# Altium project 110-00315-D_B1-DevKit_1.PrjPcb (part 2 of 5)

## Sheet 4-CPUMipiXo.SchDoc: B1 DevKit (DK-B1)
size 431 x 279 mm; Organization: ORGANIZATION; Address1: ADDRESS 1; Address2: ADDRESS 2; Address3: ADDRESS 3; Address4: ADDRESS 4; DocumentNumber: 4; Revision: -; SheetNumber: 4; SheetTotal: 14; ENG_APP_DATE: --/--/--; DSN_APP_DATE: --/--/--; CHK_APP_DATE: --/--/--
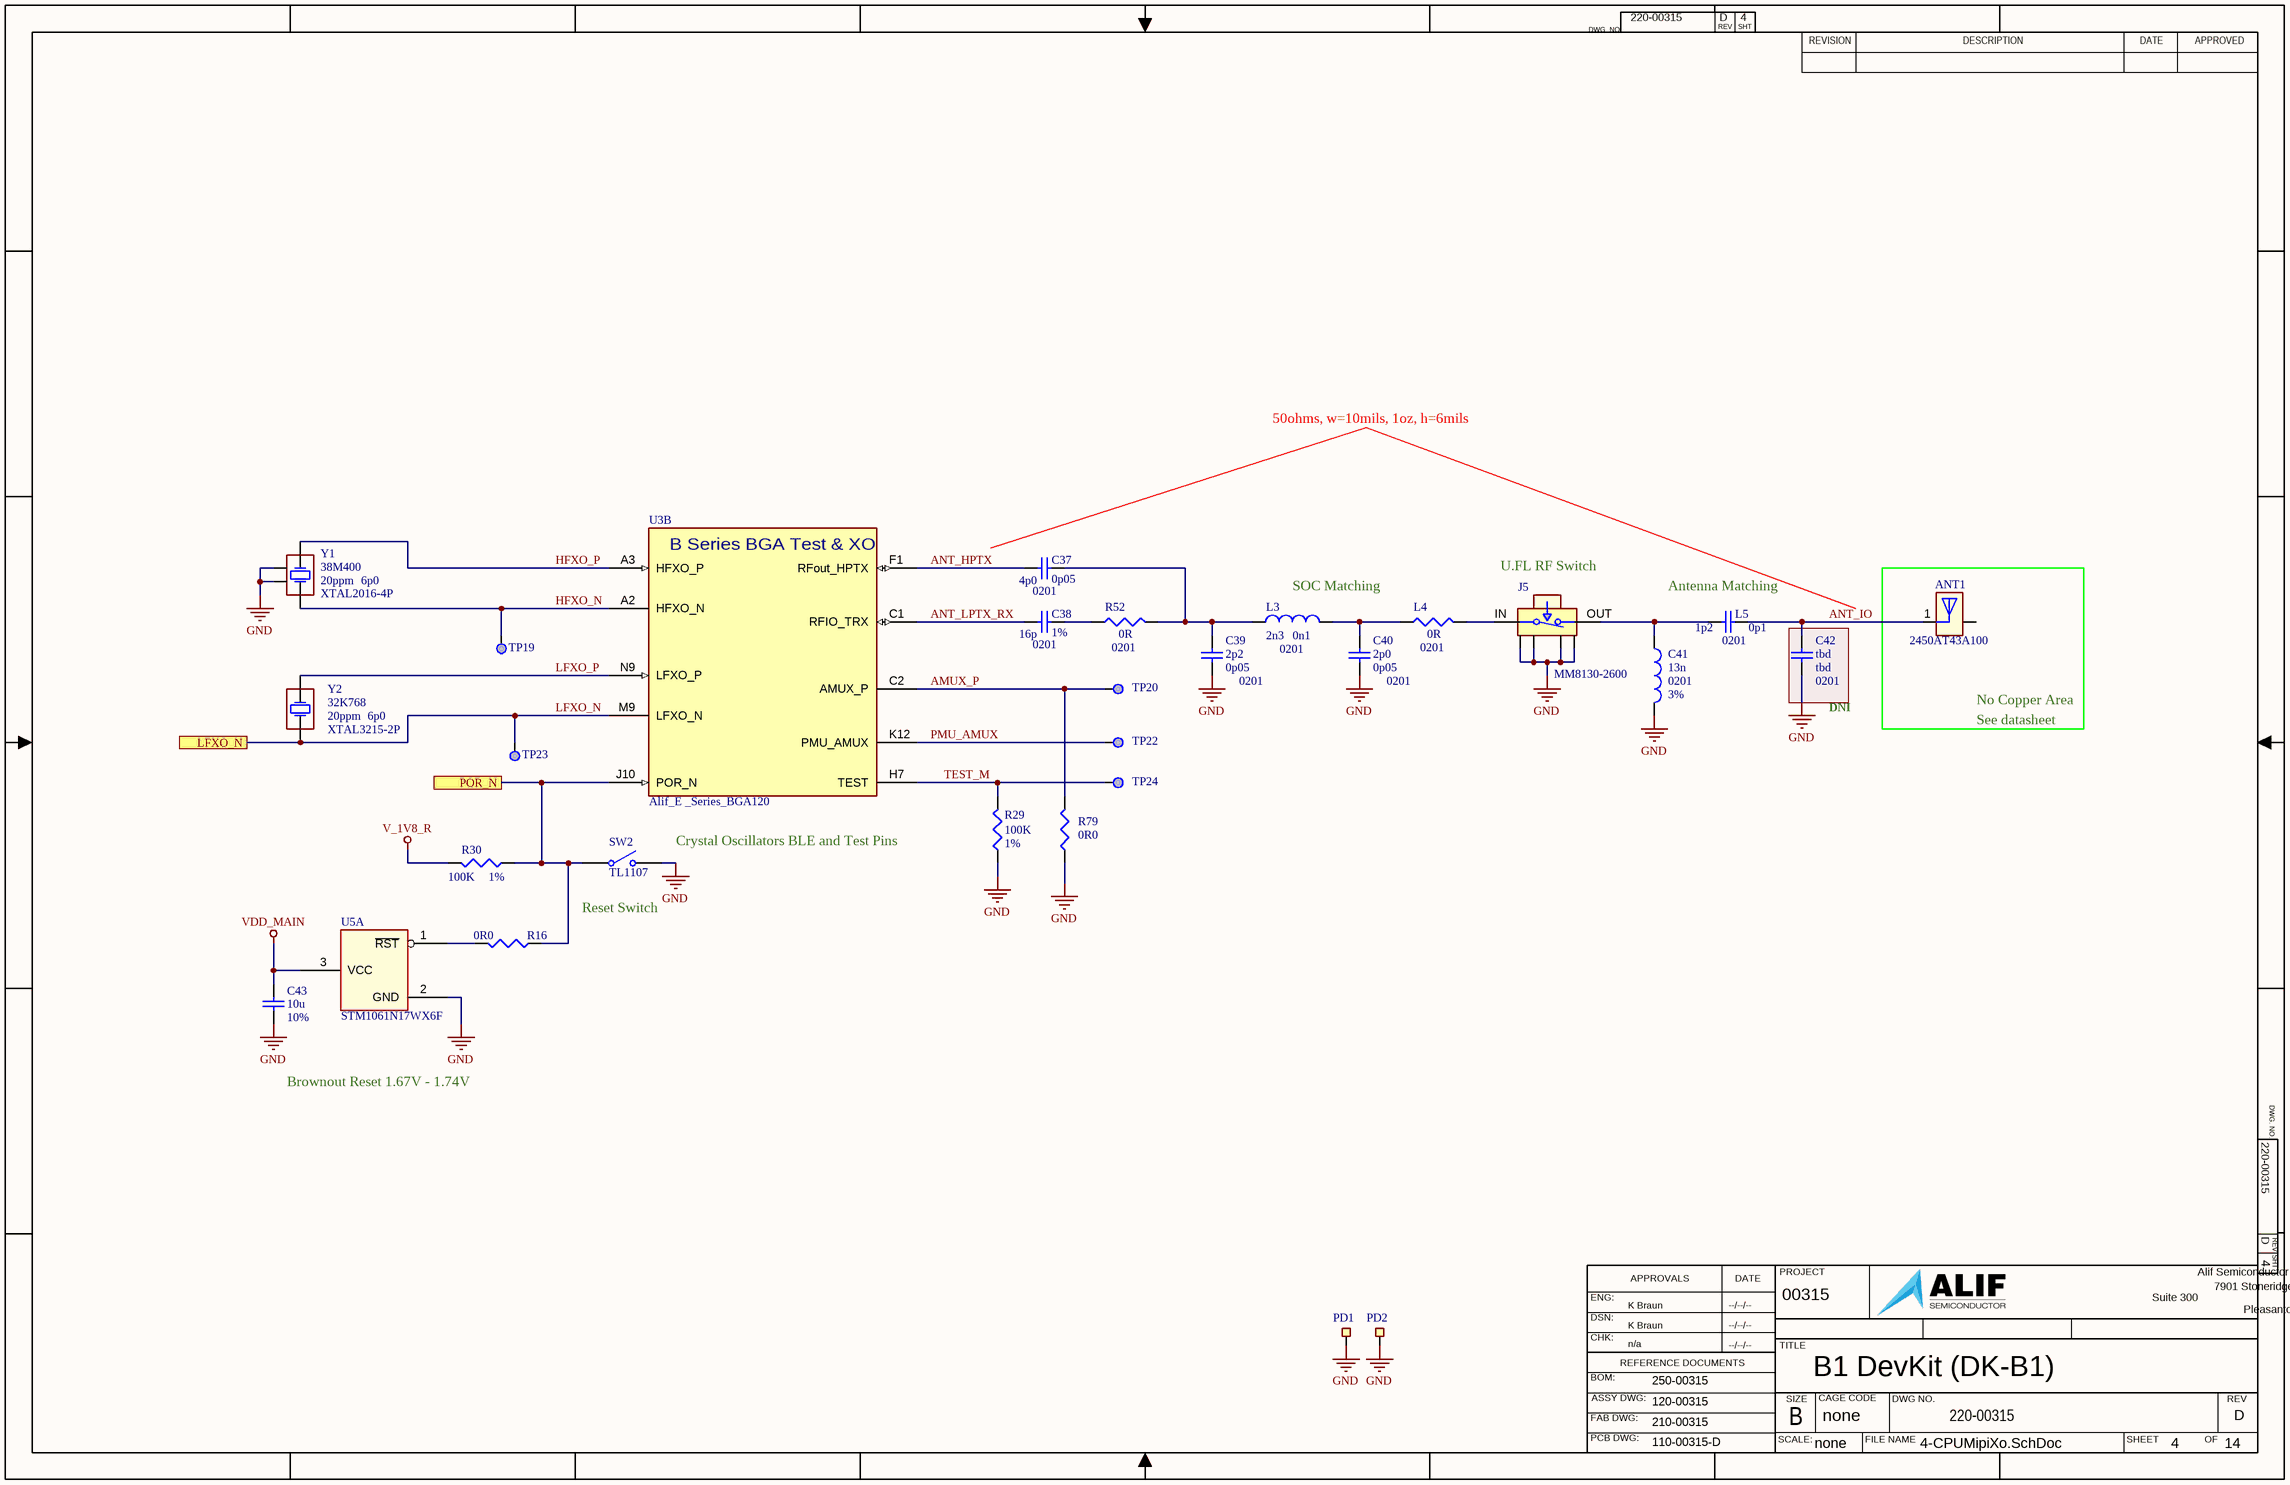
[diagram p3: 4-CPUMipiXo.SchDoc]

### Parts
ANT1  2450AT43A100  [ANT_JOT_2450AT43A100_JOD]
C37  value 4p0  PCB_Footprint: 0201  Tolerance: 0p05  [CC0201_RF10]  (hidden comment: Cap)
C38  value 16p  PCB_Footprint: 0201  Tolerance: 1%  [CC0201_RF10]  (hidden comment: Cap)
C39  value 2p2  PCB_Footprint: 0201  Tolerance: 0p05  [CC0201_RF10]  (hidden comment: Cap)
C40  value 2p0  PCB_Footprint: 0201  Tolerance: 0p05  [CC0201_RF10]  (hidden comment: Cap)
C41  value 13n  PCB_Footprint: 0201  Tolerance: 3%  [LC0201_RF10]  (hidden comment: Inductor)
C42  value tbd  PCB_Footprint: 0201  Tolerance: tbd  [CC0201_RF10]  (hidden comment: Cap)
C43  value 10u  Tolerance: 10%  [CAPC0402-01]  (hidden comment: Cap)
J5  MM8130-2600  [CONN_U.FL_SWITCH_MURATA_MM8130-2600RA2]
L3  value 2n3  PCB_Footprint: 0201  Tolerance: 0n1  [LC0201_RF10]  (hidden comment: Inductor)
L4  value 0R  PCB_Footprint: 0201  [RC0201_RF10]  (hidden comment: Res3)
L5  value 1p2  PCB_Footprint: 0201  Tolerance: 0p1  [CC0201_RF10]  (hidden comment: Cap)
PD1  PAD_10x10  [PAD_RF10x10]  (value not drawn)  (no BOM)
PD2  PAD_10x10  [PAD_RF10x10]  (value not drawn)  (no BOM)
R16  value 0R0  [RESC0402-01]  (hidden comment: Res3)
R29  value 100K  Tolerance: 1%  [RESC0402-01]  (hidden comment: Res3)
R30  value 100K  Tolerance: 1%  [RESC0402-01]  (hidden comment: Res3)
R52  value 0R  PCB_Footprint: 0201  [RC0201_RF10]  (hidden comment: Res3)
R79  value 0R0  [RESC0402-01]  (hidden comment: Res3)
SW2  value TL1107  [SW_1825966-TL1107-1]  (hidden comment: SW-SPST)
TP19  TP_SMPAD  [TP_30_RND]  (value not drawn)  (no BOM)
TP20  TP_SMPAD  [TP_30_RND]  (value not drawn)  (no BOM)
TP22  TP_SMPAD  [TP_30_RND]  (value not drawn)  (no BOM)
TP23  TP_SMPAD  [TP_30_RND]  (value not drawn)  (no BOM)
TP24  TP_SMPAD  [TP_30_RND]  (value not drawn)  (no BOM)
U3  Alif_E _Series_BGA120  [BGA120_socket-NO_SOCK_3D]  (part B of 4)
U5  STM1061N17WX6F  [SOT-23_DBZ_TEX]  (part A of 2)
Y1  value 38M400  PCB_Footprint: XTAL2016-4P  PPM: 20ppm  Load Cap: 6p0  [OSC_4p_2016_XRCGB38M400F2P00R0]  (hidden comment: Xtal_38M4_20PPM6PF_2016-4P_1)
Y2  value 32K768  PCB_Footprint: XTAL3215-2P  PPM: 20ppm  Load Cap: 6p0  [XTAL_ABS07_ABR-M]  (hidden comment: Xtal_32K768_20PPM6PF_3215-2P_1)

### Ports
LFXO_N, POR_N

### Nets
GND: C39.1 C40.1 C41.2 C42.1 C43.1 J5.G1 J5.G2 J5.G3 J5.G4 PD1.1 PD2.1 R29.1 R79.1 SW2.2(NO) U5.2(GND) Y1.2 Y1.4
V_1V8_R: R30.2
VDD_MAIN: C43.2 U5.3(VCC)
AMUX_P: R79.2 TP20.1 U3.C2(AMUX_P)
ANT_HPTX: C37.2 U3.F1(RFout_HPTX)
ANT_IO: ANT1.1(INPUT) C42.2 L5.1
ANT_LPTX_RX: C38.2 U3.C1(RFIO_TRX)
HFXO_N: TP19.1 U3.A2(HFXO_N) Y1.3(OSC2)
HFXO_P: U3.A3(HFXO_P) Y1.1(OSC1)
LFXO_N: TP23.1 U3.M9(LFXO_N) Y2.1(OSC1) ; port LFXO_N
LFXO_P: U3.N9(LFXO_P) Y2.2(OSC2)
PMU_AMUX: TP22.1 U3.K12(PMU_AMUX)
POR_N: R16.1 R30.1 SW2.1(COMMON) U3.J10(POR_N) ; port POR_N
TEST_M: R29.2 TP24.1 U3.H7(TEST)
NetC37_1: C37.1 C39.2 L3.1 R52.2
NetC38_1: C38.1 R52.1
NetC40_2: C40.2 L3.2 L4.1
NetC41_1: C41.1 J5.OUT L5.2
NetJ5_IN: J5.IN L4.2
NetR16_2: R16.2 U5.1(~{RST})

Not connected (* = marked no-connect by the designer): ANT1 3(GND)

### Notes on the sheet
- 50ohms, w=10mils, 1oz, h=6mils
- U.FL RF Switch
- SOC Matching
- (near L5) Antenna Matching
- No Copper Area
- (near C42) DNI
- See datasheet
- Crystal Oscillators BLE and Test Pins
- Reset Switch
- Brownout Reset 1.67V - 1.74V
- DWG. NO.
- REV
- SHT
- REVISION
- DESCRIPTION
- DATE
- APPROVED
- ENG:
- APPROVALS
- PROJECT
- Suite 300
- Alif Semiconductor
- 7901 Stoneridge Drive
- DSN:
- CHK:
- REFERENCE DOCUMENTS
- TITLE
- Pleasanton, CA 94588  USA
- BOM:
- FAB DWG:
- PCB DWG:
- ASSY DWG:
- SCALE:
- SIZE
- B
- CAGE CODE
- FILE NAME
- DWG NO.
- SHEET
- OF
- none
- (in symbol SPARK_B1_120BGA_A5, part B) B Series BGA Test & XO

### Library data of the parts
ANT1 = ANT_2450AT43A100: Antenna, Chip, 2.4GHz Bluetooth, ISM, Wi-Fi,  2.7dBi; Manufacturer 1: Johanson; Manufacturer Part Number 1: 2450AT43A0100001E; SnapEDA_Link: https://www.snapeda.com/parts/ACAG0201-2450-T/Abracon+LLC/view-part/?ref=snap; Package: None; Value: *; Check_prices: https://www.snapeda.com/parts/ACAG0201-2450-T/Abracon+LLC/view-part/?ref=eda
C37 = Cap_SMT: Cap,4.0pF,+-0.05pF,>=25V,C0G,0201; Manufacturer 1: MuRata; Manufacturer Part Number 1: GJM0335C1E4R0WB01D; Voltage: 25V; Published: 8-Jun-2000; LatestRevisionDate: 17-Jul-2002; LatestRevisionNote: Re-released for DXP Platform.; PackageReference: RAD-0.3; Publisher: Altium Limited; PackageDescription: Radial Cap, Thru-Hole; 2 Leads; 0.3 in Pin Spacing; Max_Height: 0.60mm; Manufacturer 2: Kemet; Manufacturer Part Number 2: CBR02C409A5GAC; Manufacturer 3: *; Manufacturer Part Number 3: *; Type: C0G
C38 = Cap_SMT: Cap,16pF,1%,50V,C0G,0201; Manufacturer 1: MuRata; Manufacturer Part Number 1: GCM0335C1H160FA16J; Voltage: 25V; Published: 8-Jun-2000; LatestRevisionDate: 17-Jul-2002; LatestRevisionNote: Re-released for DXP Platform.; PackageReference: RAD-0.3; Publisher: Altium Limited; PackageDescription: Radial Cap, Thru-Hole; 2 Leads; 0.3 in Pin Spacing; Max_Height: 0.60mm; Manufacturer 2: Kemet; Manufacturer Part Number 2: CBR02C160F8GAC; Manufacturer 3: *; Manufacturer Part Number 3: *; Type: C0G
C39 = Cap_SMT: Cap,2.2pF,+-0.05pF,>25V,C0G,0201; Manufacturer 1: MuRata; Manufacturer Part Number 1: GJM0335C1E2R2WB01D; Voltage: 25V; Published: 8-Jun-2000; LatestRevisionDate: 17-Jul-2002; LatestRevisionNote: Re-released for DXP Platform.; PackageReference: RAD-0.3; Publisher: Altium Limited; PackageDescription: Radial Cap, Thru-Hole; 2 Leads; 0.3 in Pin Spacing; Max_Height: 0.60mm; Manufacturer 2: Kemet; Manufacturer Part Number 2: CBR02C229A5GAC; Manufacturer 3: *; Manufacturer Part Number 3: *; Type: C0G
C40 = Cap_SMT: Cap,2.0pF,+-0.05pF,>25V,C0G,0201; Manufacturer 1: MuRata; Manufacturer Part Number 1: GJM0335C1E2R0WB01D; Voltage: 25V; Published: 8-Jun-2000; LatestRevisionDate: 17-Jul-2002; LatestRevisionNote: Re-released for DXP Platform.; PackageReference: RAD-0.3; Publisher: Altium Limited; PackageDescription: Radial Cap, Thru-Hole; 2 Leads; 0.3 in Pin Spacing; Max_Height: 0.60mm; Manufacturer 2: Yageo; Manufacturer Part Number 2: CQ0201ARNPO9BN2R0; Manufacturer 3: *; Manufacturer Part Number 3: *; Type: C0G
C41 = Inductor: Ind,13nH,+-3%,>300mA,ESR < 800mOhm,SRF >4.3GHz,Q >12 @ 500MHz,0201; Manufacturer 1: MuRata; Manufacturer Part Number 1: LQP03TN13NH02D; DCR: 800m; RMS_Current: 250mA; Published: 8-Jun-2000; LatestRevisionDate: 29-May-2009; LatestRevisionNote: IPC-7351 Footprint Added.; PackageReference: 0402-A; Publisher: Altium Limited; PackageDescription: Chip Inductor; Code_JEITA: 0201; Code_IEC: 0201; Sat_Current: *; Impedance: *; Type: *; Manufacturer 2: MuRata; Manufacturer Part Number 2: LQP03HQ13NH02D; Manufacturer 3: Abracon; Manufacturer Part Number 3: AIMC-Q0201HQ-13NH-T; Max_Height: 0.45mm
C42 = Cap_SMT: DNI,Cap,tbd,tbd,>25V,C0G,0201; Voltage: 25V; Published: 8-Jun-2000; LatestRevisionDate: 17-Jul-2002; LatestRevisionNote: Re-released for DXP Platform.; PackageReference: RAD-0.3; Publisher: Altium Limited; PackageDescription: Radial Cap, Thru-Hole; 2 Leads; 0.3 in Pin Spacing; Max_Height: 0.60mm; Manufacturer 1: *; Manufacturer Part Number 1: *; Manufacturer 2: *; Manufacturer Part Number 2: *; Manufacturer 3: *; Manufacturer Part Number 3: *; Type: C0G
C43 = Cap: as C4 on sheet 2-PowerInput; Published: 8-Jun-2000; LatestRevisionDate: 17-Jul-2002; LatestRevisionNote: Re-released for DXP Platform.; PackageReference: RAD-0.3; Publisher: Altium Limited; PackageDescription: Radial Cap, Thru-Hole; 2 Leads; 0.3 in Pin Spacing; Max_Height: 0.60mm; Manufacturer 2: Samsung; Manufacturer Part Number 2: CL05A106MP5NUNC; Manufacturer 3: Venkel; Manufacturer Part Number 3: C0402X5R100-106MNP; Type: X5R; Voltage: 10V
J5 = CONN_U.FL_SWITCH_MM8130-2600: Conn,U.FL, Switch, Male Pin 50Ohm 6-Pin SMT; Manufacturer 1: MyRata; Manufacturer Part Number 1: MM8130-2600R; Datasheet Link: https://www.te.com/commerce/DocumentDelivery/DDEController?Action=showdoc&DocId=Customer+Drawing%7F2081956%7FA%7Fpdf%7FEnglish%7FENG_CD_2081956_A.pdf%7F2081956-1; Height: 1.05mm
L3 = Inductor: Ind,2.3nH,+-0.1nH,>500mA,ESR < 250mOhm,SRF >7GHz,Q >20 @ 500MHz,0201; Manufacturer 1: MuRata; Manufacturer Part Number 1: LQP03HQ2N3B02D; DCR: 170m; RMS_Current: 500mA; Published: 8-Jun-2000; LatestRevisionDate: 29-May-2009; LatestRevisionNote: IPC-7351 Footprint Added.; PackageReference: 0402-A; Publisher: Altium Limited; PackageDescription: Chip Inductor; Code_JEITA: 0201; Code_IEC: 0201; Sat_Current: *; Impedance: *; Type: *; Manufacturer 2: TDK; Manufacturer Part Number 2: MHQ0603P2N3BT000; Manufacturer 3: *; Manufacturer Part Number 3: *; Max_Height: 0.45mm
L4 = Res3: Res,0R ohm,Jumper,0201; Manufacturer 1: KOA; Manufacturer Part Number 1: RK73Z1HTTC; Wattage: 50mW; Type: Thick Film; Tolerance: 1%; Published: 8-Jun-2000; LatestRevisionDate: 29-May-2009; LatestRevisionNote: IPC-7351 Footprint Added.; PackageReference: 0201; Publisher: Altium Limited; PackageDescription: Chip Resistor; Voltage: *; Manufacturer 2: Stackpol; Manufacturer Part Number 2: RMCF0201ZT0R00; Manufacturer 3: Panasonic; Manufacturer Part Number 3: ERJ-1GN0R00C
L5 = Cap_SMT: Cap,1.2pF,<+-0.10pF,25-50V,C0G,0201; Manufacturer 1: MuRata; Manufacturer Part Number 1: GJM0335C1E1R2BB01D; Voltage: 50V; Published: 8-Jun-2000; LatestRevisionDate: 17-Jul-2002; LatestRevisionNote: Re-released for DXP Platform.; PackageReference: RAD-0.3; Publisher: Altium Limited; PackageDescription: Radial Cap, Thru-Hole; 2 Leads; 0.3 in Pin Spacing; Max_Height: 0.60mm; Manufacturer 2: Kemet; Manufacturer Part Number 2: CBR02C129B3GAC; Manufacturer 3: Kyosera; Manufacturer Part Number 3: CU01311R2BAT2A; Type: C0G
PD1 PD2 = PAD_0101: Test Point, SMT Pad,--not a BOM item--; PCB_Footprint: TP_PAD10x10
R16 R79 = Res3: Res,0R ohm,Jumper,0402; Manufacturer 1: Stackpol; Manufacturer Part Number 1: RMCF0402ZT0R00; Wattage: 63mW; Tolerance: JMPR; Published: 8-Jun-2000; LatestRevisionDate: 29-May-2009; LatestRevisionNote: IPC-7351 Footprint Added.; PackageReference: RESC0402-01; Publisher: Altium Limited; PackageDescription: Chip Resistor; Voltage: *; Type: Thick Film; Manufacturer 2: Yageo; Manufacturer Part Number 2: RC0402FR-070RL; Manufacturer 3: Panasonic; Manufacturer Part Number 3: ERJ-XGN0R00Y; PCB_Footprint: RESC0402-01
R29 R30 = Res3: as R11 on sheet 2-PowerInput; Published: 8-Jun-2000; LatestRevisionDate: 29-May-2009; LatestRevisionNote: IPC-7351 Footprint Added.; PackageReference: RESC0402-01; Publisher: Altium Limited; PackageDescription: Chip Resistor; Voltage: *; Type: Thick Film; Manufacturer 2: Yageo; Manufacturer Part Number 2: RC0402FR-07100KL; Manufacturer 3: Bourns; Manufacturer Part Number 3: CR0402-FX-1003GLF; PCB_Footprint: RESC0402-01
R52 = Res3: Res,0R ohm,Jumper,0201; Manufacturer 1: KOA; Manufacturer Part Number 1: RK73Z1HTTC; Wattage: 50mW; Tolerance: 1%; Published: 8-Jun-2000; LatestRevisionDate: 29-May-2009; LatestRevisionNote: IPC-7351 Footprint Added.; PackageReference: 0201; Publisher: Altium Limited; PackageDescription: Chip Resistor; Voltage: *; Type: Thick Film; Manufacturer 2: Stackpol; Manufacturer Part Number 2: RMCF0201ZT0R00; Manufacturer 3: Panasonic; Manufacturer Part Number 3: ERJ-1GN0R00C
SW2 = SW-SPST: Swit, SPST, Momentary Pushputton, 2 pin, 6.0x3.5mm, H=5.0mm; Manufacturer 1: E-Switch; Manufacturer Part Number 1: TL1107BF180WQ; Published: 24-Mar-1999; LatestRevisionDate: 17-Jul-2002; LatestRevisionNote: Re-released for DXP Platform.; PackageReference: SPST-2; Publisher: Altium Limited; PackageDescription: Switch; 2 Leads; Manufacturer 2: C&K; Manufacturer Part Number 2: PTS636 SM50 LFS; Manufacturer 3: Panasonic; Manufacturer Part Number 3: EVQ-PE505K
TP19 TP20 TP22-TP24 = TP_SMPAD: as TP1 on sheet 2-PowerInput
U3 = SPARK_B1_120BGA_A5: as U3 on sheet 3-CPUPower
U5 = IC_SUP_STM1061N17WX6F: IC,PMIC Volt Supervisor, -Reset OD, 1.7V, 2%, 900nA, SOT23-3; Manufacturer 1: ST Micro; Manufacturer Part Number 1: STM1061N17WX6F; Manufacturer 2: *; Manufacturer Part Number 2: *
Y1 = Xtal_38M4_20PPM6PF_2016-4P_1: Crystal,38.4MHz,20ppm,6.0pF,100ohm,2016-4pin; Manufacturer 1: Murata; Manufacturer Part Number 1: XRCGB38M400F2P00R0; ESR: 100; Published: 8-Jun-2000; LatestRevisionDate: 17-Jul-2002; LatestRevisionNote: Re-released for DXP Platform.; PackageReference: R38; Publisher: Altium Limited; PackageDescription: Crystal, Thru-Hole; 2 Leads; Body 3.1 x 8.2 mm (Dia.xH); Max_Height: 0.65mm
Y2 = Xtal_32K768_20PPM6PF_3215-2P_1: Crystal, 32.768KHz, 20ppm, 6pF, <70Kohm, 3215-2pin; Manufacturer 1: Epson; Manufacturer Part Number 1: FC-135R 32.7680KF-E; ESR: 70Kohm; Published: 8-Jun-2000; LatestRevisionDate: 17-Jul-2002; LatestRevisionNote: Re-released for DXP Platform.; PackageReference: R38; Publisher: Altium Limited; PackageDescription: Crystal, Thru-Hole; 2 Leads; Body 3.1 x 8.2 mm (Dia.xH); Max_Height: 0.60mm; Manufacturer 2: Abracon; Manufacturer Part Number 2: ABS07-32.768KHZ-6-T

## Sheet 5-Memory.SchDoc: B1 DevKit (DK-B1)
size 431 x 279 mm; Organization: ORGANIZATION; Address1: ADDRESS 1; Address2: ADDRESS 2; Address3: ADDRESS 3; Address4: ADDRESS 4; DocumentNumber: 5; Revision: -; SheetNumber: 5; SheetTotal: 14; ENG_APP_DATE: --/--/--; DSN_APP_DATE: --/--/--; CHK_APP_DATE: --/--/--
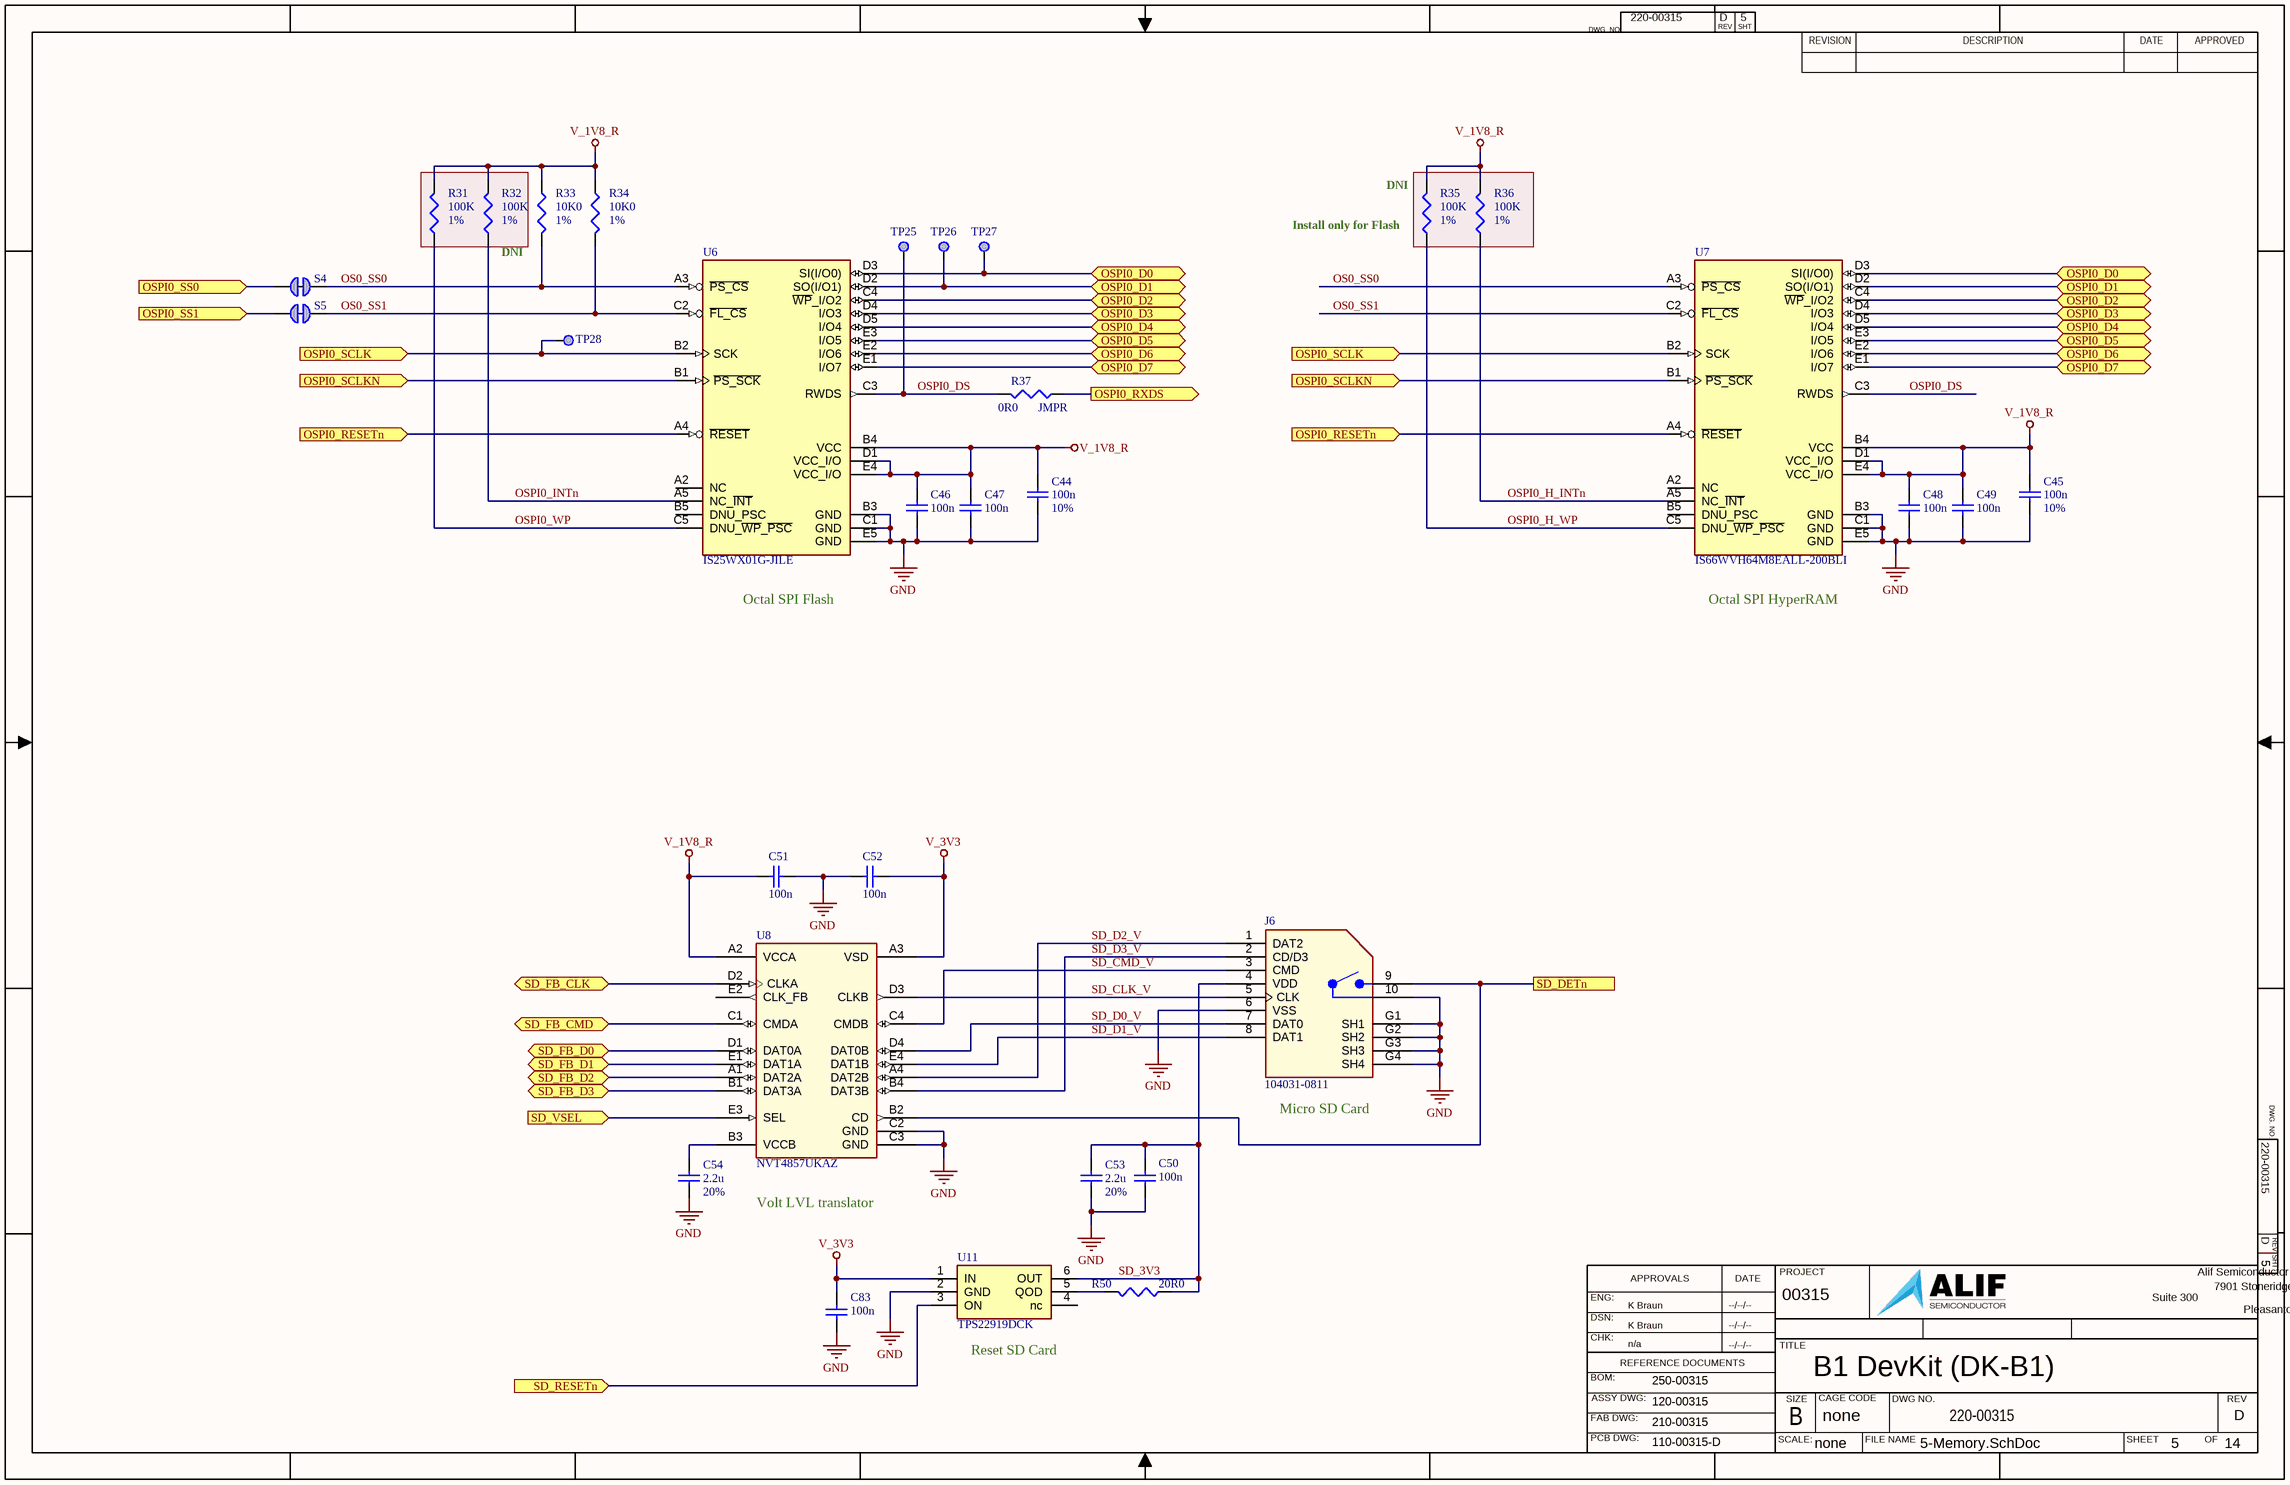
[diagram p4: 5-Memory.SchDoc]

### Parts
C44  value 100n  Tolerance: 10%  [CAPC0402-01]  (hidden comment: Cap)
C45  value 100n  Tolerance: 10%  [CAPC0402-01]  (hidden comment: Cap)
C46  value 100n  [CAPC0402-01]  (hidden comment: Cap)
C47  value 100n  [CAPC0402-01]  (hidden comment: Cap)
C48  value 100n  [CAPC0402-01]  (hidden comment: Cap)
C49  value 100n  [CAPC0402-01]  (hidden comment: Cap)
C50  value 100n  [CAPC0402-01]  (hidden comment: Cap)
C51  value 100n  [CAPC0402-01]  (hidden comment: Cap)
C52  value 100n  [CAPC0402-01]  (hidden comment: Cap)
C53  value 2.2u  Tolerance: 20%  [CAPC0402-01]  (hidden comment: Cap_225M25VX5R0402_1)
C54  value 2.2u  Tolerance: 20%  [CAPC0402-01]  (hidden comment: Cap_225M25VX5R0402_1)
C83  value 100n  [CAPC0402-01]  (hidden comment: Cap)
J6  104031-0811  [CONN_SD_MOLEX_104031-0811]
R31  value 100K  Tolerance: 1%  [RESC0402-01]  (hidden comment: Res3)
R32  value 100K  Tolerance: 1%  [RESC0402-01]  (hidden comment: Res3)
R33  value 10K0  Tolerance: 1%  [RESC0402-01]  (hidden comment: Res3)
R34  value 10K0  Tolerance: 1%  [RESC0402-01]  (hidden comment: Res3)
R35  value 100K  Tolerance: 1%  [RESC0402-01]  (hidden comment: Res3)
R36  value 100K  Tolerance: 1%  [RESC0402-01]  (hidden comment: Res3)
R37  value 0R0  Tolerance: JMPR  [RESC0402-01]  (hidden comment: Res3)
R50  value 20R0  [RESC0402-01]  (hidden comment: Res3)
S4  SolderJumperShorted_Small  [Solderbridge_Shorted]  (value not drawn)  (net tie, no BOM)
S5  SolderJumperShorted_Small  [Solderbridge_Shorted]  (value not drawn)  (net tie, no BOM)
TP25  TP_SMPAD  [TP_30_RND]  (value not drawn)  (no BOM)
TP26  TP_SMPAD  [TP_30_RND]  (value not drawn)  (no BOM)
TP27  TP_SMPAD  [TP_30_RND]  (value not drawn)  (no BOM)
TP28  TP_SMPAD  [TP_30_RND]  (value not drawn)  (no BOM)
U6  Manufacturer Part Number 1: IS25WX01G-JILE  [BGA24C100P5X5_800X600X100N]  (hidden comment: IC_OctalSPI_Generic_1)
U7  Manufacturer Part Number 1: IS66WVH64M8EALL-200BLI  [BGA24C100P5X5_800X600X100N]  (hidden comment: IC_OctalSPI_Generic_1)
U8  NVT4857UKAZ  [WLCSP20_NVT4857_NXP]
U11  TPS22919DCK  [SOT363_DIO]

### Ports
OSPI0_D0 (bidir), OSPI0_D1 (bidir), OSPI0_D2 (bidir), OSPI0_D3 (bidir), OSPI0_D4 (bidir), OSPI0_D5 (bidir), OSPI0_D6 (bidir), OSPI0_D7 (bidir), OSPI0_RESETn (in), OSPI0_RXDS (out), OSPI0_SCLK (in), OSPI0_SCLKN (in), OSPI0_SS0 (in), OSPI0_SS1 (in), SD_DETn, SD_FB_CLK (bidir), SD_FB_CMD (bidir), SD_FB_D0 (bidir), SD_FB_D1 (bidir), SD_FB_D2 (bidir), SD_FB_D3 (bidir), SD_RESETn (in), SD_VSEL (in)

### Nets
GND: C44.1 C45.1 C46.1 C47.1 C48.1 C49.1 C50.1 C51.1 C52.2 C53.1 C54.1 C83.1 J6.6(VSS) J6.10(CD_B) J6.G1(SH1) J6.G2(SH2) J6.G3(SH3) J6.G4(SH4) U6.B3(GND) U6.C1(GND) U6.E5(GND) U7.B3(GND) U7.C1(GND) U7.E5(GND) U8.C2(GND) U8.C3(GND) U11.2(GND)
V_1V8_R: C44.2 C45.2 C46.2 C47.2 C48.2 C49.2 C51.2 R31.2 R32.2 R33.1 R34.1 R35.2 R36.2 U6.B4(VCC) U6.D1(VCC_I/O) U6.E4(VCC_I/O) U7.B4(VCC) U7.D1(VCC_I/O) U7.E4(VCC_I/O) U8.A2(VCCA)
V_3V3: C52.1 C83.2 U8.A3(VSD) U11.1(IN)
OS0_SS0: R33.2 S4.2 U6.A3(~{PS_CS}) U7.A3(~{PS_CS})
OS0_SS1: R34.2 S5.2 U6.C2(~{FL_CS}) U7.C2(~{FL_CS})
OSPI0_DS: R37.2 TP25.1 U6.C3(RWDS) U7.C3(RWDS)
OSPI0_H_INTn: R36.1 U7.A5(NC_~{INT})
OSPI0_H_WP: R35.1 U7.C5(DNU_~{WP}_~{PSC})
OSPI0_INTn: R32.1 U6.A5(NC_~{INT})
OSPI0_WP: R31.1 U6.C5(DNU_~{WP}_~{PSC})
P0_2: S4.1 ; port OSPI0_SS0
P0_4: U8.E3(SEL) ; port SD_VSEL
P2_1: S5.1 ; port OSPI0_SS1
P2_6: U8.C1(CMDA) ; port SD_FB_CMD
P2_7: U8.D2(CLKA) ; port SD_FB_CLK
P3_0: TP27.1 U6.D3(SI(I/O0)) U7.D3(SI(I/O0)) ; port OSPI0_D0
P3_1: TP26.1 U6.D2(SO(I/O1)) U7.D2(SO(I/O1)) ; port OSPI0_D1
P3_2: U6.C4(~{WP}_I/O2) U7.C4(~{WP}_I/O2) ; port OSPI0_D2
P3_3: U6.D4(I/O3) U7.D4(I/O3) ; port OSPI0_D3
P3_4: U6.D5(I/O4) U7.D5(I/O4) ; port OSPI0_D4
P3_5: U6.E3(I/O5) U7.E3(I/O5) ; port OSPI0_D5
P3_6: U6.E2(I/O6) U7.E2(I/O6) ; port OSPI0_D6
P3_7: U6.E1(I/O7) U7.E1(I/O7) ; port OSPI0_D7
P4_0: U6.B1(~{PS_SCK}) U7.B1(~{PS_SCK}) ; port OSPI0_SCLKN
P4_1: R37.1 ; port OSPI0_RXDS
P4_2: TP28.1 U6.B2(SCK) U7.B2(SCK) ; port OSPI0_SCLK
P6_0: U8.D1(DAT0A) ; port SD_FB_D0
P6_1: U8.E1(DAT1A) ; port SD_FB_D1
P6_2: U8.A1(DAT2A) ; port SD_FB_D2
P6_3: U8.B1(DAT3A) ; port SD_FB_D3
P6_5: J6.9(CD_A) U8.B2(CD) ; port SD_DETn
P7_0: U11.3(ON) ; port SD_RESETn
P15_1: U6.A4(~{RESET}) U7.A4(~{RESET}) ; port OSPI0_RESETn
SD_3V3: C50.2 C53.2 J6.4(VDD) R50.1 U11.6(OUT)
SD_CLK_V: J6.5(CLK) U8.D3(CLKB)
SD_CMD_V: J6.3(CMD) U8.C4(CMDB)
SD_D0_V: J6.7(DAT0) U8.D4(DAT0B)
SD_D1_V: J6.8(DAT1) U8.E4(DAT1B)
SD_D2_V: J6.1(DAT2) U8.A4(DAT2B)
SD_D3_V: J6.2(CD/D3) U8.B4(DAT3B)
NetC54_2: C54.2 U8.B3(VCCB)
NetR50_2: R50.2 U11.5(QOD)

Not connected (* = marked no-connect by the designer): U6 A2(NC) B5(DNU_PSC); U7 A2(NC) B5(DNU_PSC); U8 E2(CLK_FB); U11 4(nc)

### Notes on the sheet
- (near R35) Install only for Flash
- (near R35) DNI
- DNI
- (near U6) Octal SPI Flash
- (near U7) Octal SPI HyperRAM
- (near J6) Micro SD Card
- Volt LVL translator
- (near U11) Reset SD Card
- DWG. NO.
- REV
- SHT
- REVISION
- DESCRIPTION
- DATE
- APPROVED
- ENG:
- APPROVALS
- PROJECT
- Suite 300
- Alif Semiconductor
- 7901 Stoneridge Drive
- DSN:
- CHK:
- REFERENCE DOCUMENTS
- TITLE
- Pleasanton, CA 94588  USA
- BOM:
- FAB DWG:
- PCB DWG:
- ASSY DWG:
- SCALE:
- SIZE
- B
- CAGE CODE
- FILE NAME
- DWG NO.
- SHEET
- OF
- none

### Library data of the parts
C44-C52 C83 = Cap: as C21 on sheet 3-CPUPower; Published: 8-Jun-2000; LatestRevisionDate: 17-Jul-2002; LatestRevisionNote: Re-released for DXP Platform.; PackageReference: RAD-0.3; Publisher: Altium Limited; PackageDescription: Radial Cap, Thru-Hole; 2 Leads; 0.3 in Pin Spacing; Max_Height: 0.60mm; Manufacturer 2: Samsung; Manufacturer Part Number 2: CL05B104KB54PNC; Manufacturer 3: Walsin; Manufacturer Part Number 3: 0402B104K500CT; Type: X7R; Voltage: 50V
  C46-C52 C83: Tolerance: 10%
C53 C54 = Cap_225M25VX5R0402_1: as C6 on sheet 2-PowerInput; Published: 8-Jun-2000; LatestRevisionDate: 17-Jul-2002; LatestRevisionNote: Re-released for DXP Platform.; PackageReference: RAD-0.3; Publisher: Altium Limited; PackageDescription: Radial Cap, Thru-Hole; 2 Leads; 0.3 in Pin Spacing; Max_Height: 0.60mm; Type: X5R; Voltage: 25V; Manufacturer 2: Murata; Manufacturer Part Number 2: GRM155R61E225ME11D; Manufacturer 3: Murata; Manufacturer Part Number 3: GRM155R61E225ME15D
J6 = Conn_SD_Molex CN-SD-8-2SW-2S: Conn,Micro SD Card w/ switch, RA, 8-Pin SMD; Voltage Rating: 10VAC/DC; Number of Contacts: 8; Insertion - Extraction Style: Push-Pull; Pitch: 1.1mm; Mating Cycles: 10000; Brand: Molex; Current Rating: 500mA; Manufacturer URL: http://www.molex.com/; Card Type: microSD; Mounting Type: Standard; Height: 1.42mm; Mounting Technology: SurfaceMount; Contact Plating: Gold; Product Category: MemoryCardConnectors; Package Description: 8-Pin Surface Mount Device, Body 11.95 x 11.4 mm, Pitch 1.1 mm; Datasheet URL: http://www.molex.com/pdm_docs/sd/1040310811_sd.pdf; Termination Style: SMD; Length: 11.4mm; Housing Material: LiquidCrystalPolymer(LCP); Orientation: RightAngle; RoHS: True; Contact Material: PhosphorBronze; Datasheet Version: Rev. E, 04/2006; Packaging: Reel; Manufacturer 1: Molex; Manufacturer Part Number 1: 104031-0811; Product: CardConnectors; Number of Rows: 1Row; Package Reference: 104031-0811
R31 R32 R35 R36 = Res3: DNI,Res,100K,1%,100ppm,0402; Manufacturer 1: Stackpol; Manufacturer Part Number 1: RMCF0402FT100K; Wattage: 63mW; Published: 8-Jun-2000; LatestRevisionDate: 29-May-2009; LatestRevisionNote: IPC-7351 Footprint Added.; PackageReference: RESC0402-01; Publisher: Altium Limited; PackageDescription: Chip Resistor; Voltage: *; Type: Thick Film; Manufacturer 2: Yageo; Manufacturer Part Number 2: RC0402FR-07100KL; Manufacturer 3: Bourns; Manufacturer Part Number 3: CR0402-FX-1003GLF; PCB_Footprint: RESC0402-01
R33 R34 = Res3: Res,10K0,1%,100ppm,0402; Manufacturer 1: Stackpol; Manufacturer Part Number 1: RMCF0402FT10K0; Wattage: 63mW; Published: 8-Jun-2000; LatestRevisionDate: 29-May-2009; LatestRevisionNote: IPC-7351 Footprint Added.; PackageReference: RESC0402-01; Publisher: Altium Limited; PackageDescription: Chip Resistor; Voltage: *; Type: Thick Film; Manufacturer 2: Yageo; Manufacturer Part Number 2: RC0402FR-0710KL; Manufacturer 3: Bourns; Manufacturer Part Number 3: CR0402-FX-1002GLF; PCB_Footprint: RESC0402-01
R37 = Res3: as R5 on sheet 2-PowerInput; Published: 8-Jun-2000; LatestRevisionDate: 29-May-2009; LatestRevisionNote: IPC-7351 Footprint Added.; PackageReference: RESC0402-01; Publisher: Altium Limited; PackageDescription: Chip Resistor; Voltage: *; Type: Thick Film; Manufacturer 2: Yageo; Manufacturer Part Number 2: RC0402FR-070RL; Manufacturer 3: Panasonic; Manufacturer Part Number 3: ERJ-XGN0R00Y; PCB_Footprint: RESC0402-01
R50 = Res3: Res,20R0,1%,100ppm,0402; Manufacturer 1: Stackpol; Manufacturer Part Number 1: RMCF0402FT20R; Wattage: 63mW; Published: 8-Jun-2000; LatestRevisionDate: 29-May-2009; LatestRevisionNote: IPC-7351 Footprint Added.; PackageReference: RESC0402-01; Publisher: Altium Limited; PackageDescription: Chip Resistor; Voltage: *; Type: Thick Film; Manufacturer 2: Yageo; Manufacturer Part Number 2: RC0402FR-0720RL; Manufacturer 3: Bourns; Manufacturer Part Number 3: CR0402-FX-20R0GLF; PCB_Footprint: RESC0402-01; Tolerance: 1%
S4 S5 = SolderJumperShorted_Small: as S1 on sheet 2-PowerInput; Published: 8-Jun-2000; LatestRevisionDate: 29-May-2009; LatestRevisionNote: IPC-7351 Footprint Added.; PackageReference: J1-0603; Publisher: Altium Limited; PackageDescription: Chip Resistor; Voltage: *; Type: Thick Film; Manufacturer 1: *; Manufacturer Part Number 1: *; Manufacturer 2: *; Manufacturer Part Number 2: *; Manufacturer 3: *; Manufacturer Part Number 3: *; Tolerance: *; Value: *
TP25-TP28 = TP_SMPAD: as TP1 on sheet 2-PowerInput
U6 = IC_OctalSPI_Generic_1: IC, Flash,128MB x 8, Octal SPI, Ind Temp, 1.8V,24-BGA; Manufacturer 1: ISSI; Value: *; Availability: Warning; Price: None; SnapEDA_Link: https://www.snapeda.com/parts/ATXP128-CCUE-Y/Dialog%20Semiconductor/view-part/5488799/?ref=snap; Check_prices: https://www.snapeda.com/parts/ATXP128-CCUE-Y/Dialog%20Semiconductor/view-part/5488799/?ref=eda; MF: *; Purchase-URL: https://pricing.snapeda.com/search/part/ATXP128-CCUE-Y/?ref=eda; Package: BGA-24 Dialog Semiconductor; MP: *; Manufacturer 2: *; Manufacturer Part Number 2: *; Manufacturer 3: *; Manufacturer Part Number 3: *
U7 = IC_OctalSPI_Generic_1: IC, Hyper PSRAM,64MB x 8, Octal SPI, Ind Temp, 1.8V,24-BGA; Manufacturer 1: ISSI; Value: *; Availability: *; Price: *; SnapEDA_Link: *; Check_prices: *; MF: *; Purchase-URL: *; Package: *; MP: *; Manufacturer 2: ISSI; Manufacturer Part Number 2: IS67WVH64M8EALL-200BLA1; Manufacturer 3: ISSI; Manufacturer Part Number 3: IS66WVH64M8EALL-166BLI
U8 = IC_XLAT_NVT4857UK: IC, Voltage Level Translator, 6-bit,push-pull,208Mbps,VCC(A): 1.2V to 1.8V and VCC(B): 1.8V to 3.0V,auto-sense,WLCSP20; Manufacturer 1: NXP; Manufacturer Part Number 1: NVT4857UKAZ; Type: Type; Manufacturer 2: 3Peak; Manufacturer Part Number 2: TPT24857-WS8R-S
U11 = IC_SWIT_TPS22919DCK: IC, Power Switch, Enable, Soft Start, Quick Discharge, 1.6V - 5.5V, 1.5A, SC-70 (SOT-363); Manufacturer 1: TI; Datasheet Link: *; Height: *; Manufacturer Part Number 1: TPS22919DCK; Mouser Part Number: *; Mouser Price/Stock: https://www.mouser.co.uk/ProductDetail/ams/TCS34103M?qs=eP2BKZSCXI7tifzA10IIyw%3D%3D

## Sheet 6-CODEC.SchDoc: B1 DevKit (DK-B1)
size 431 x 279 mm; Organization: ORGANIZATION; Address1: ADDRESS 1; Address2: ADDRESS 2; Address3: ADDRESS 3; Address4: ADDRESS 4; DocumentNumber: 6; Revision: -; SheetNumber: 6; SheetTotal: 14; ENG_APP_DATE: --/--/--; DSN_APP_DATE: --/--/--; CHK_APP_DATE: --/--/--
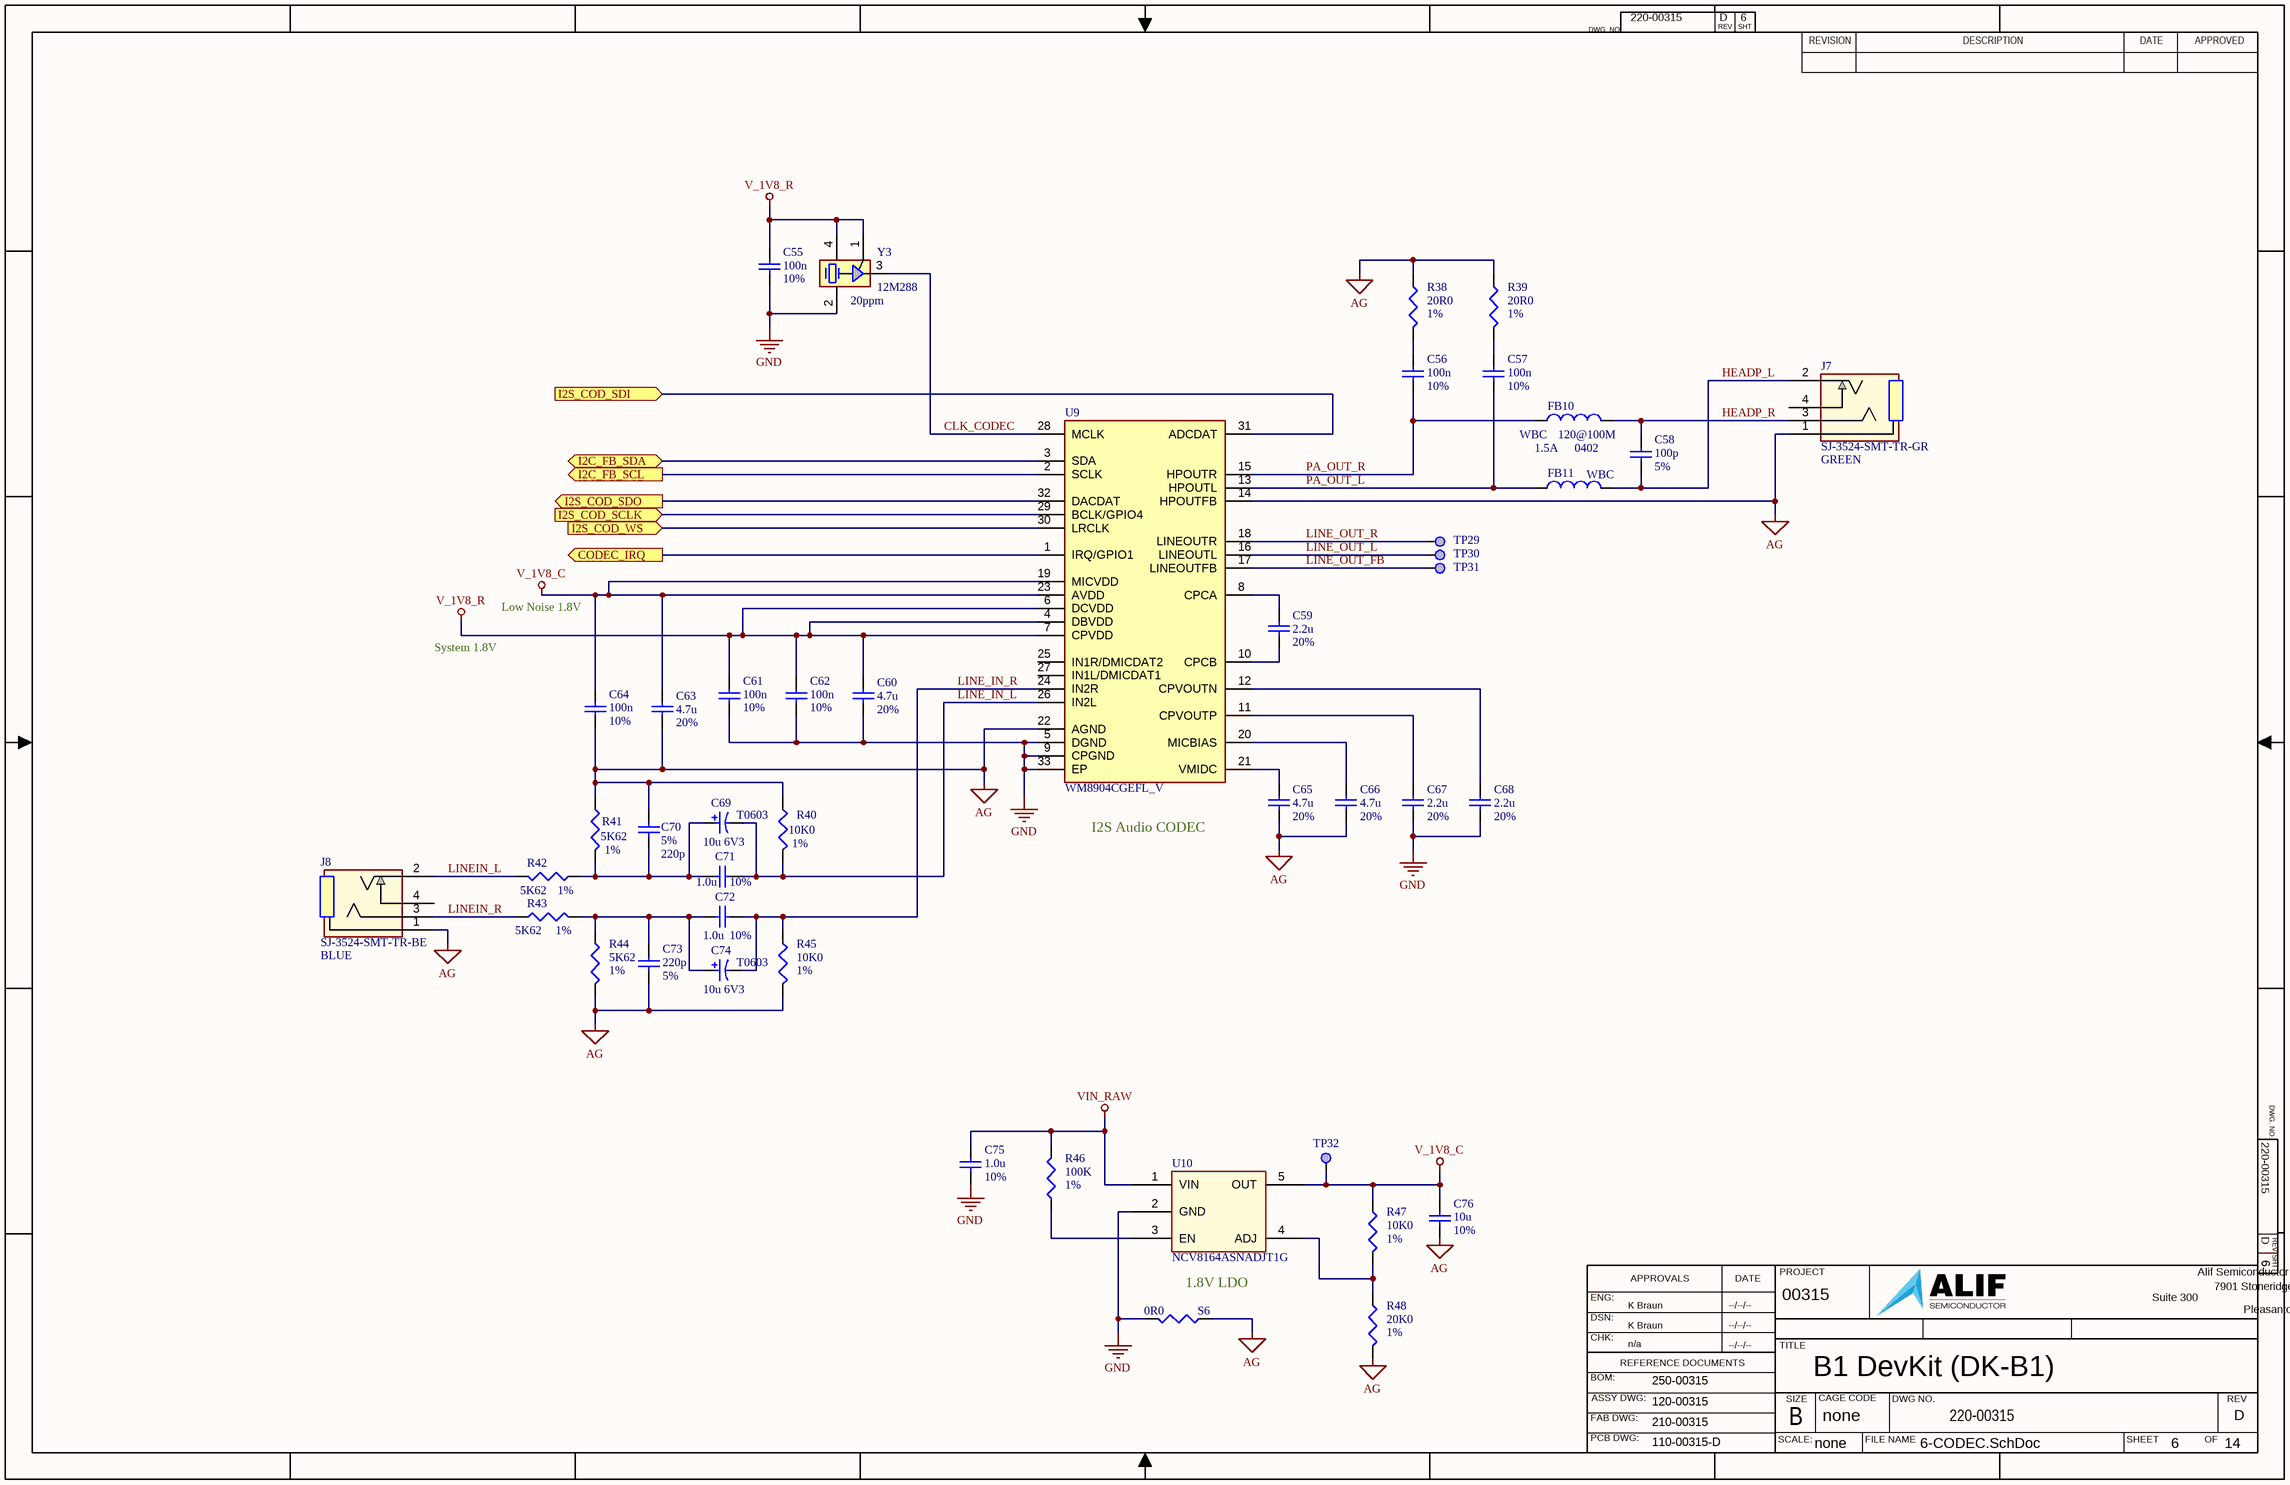
[diagram p5: 6-CODEC.SchDoc]

### Parts
C55  value 100n  Tolerance: 10%  [CAPC0402-01]  (hidden comment: Cap)
C56  value 100n  Tolerance: 10%  [CAPC0402-01]  (hidden comment: Cap)
C57  value 100n  Tolerance: 10%  [CAPC0402-01]  (hidden comment: Cap)
C58  value 100p  Tolerance: 5%  [CAPC0402-01]  (hidden comment: Cap)
C59  value 2.2u  Tolerance: 20%  [CAPC0402-01]  (hidden comment: Cap_225M25VX5R0402_1)
C60  value 4.7u  Tolerance: 20%  [CAPC0402-01]  (hidden comment: Cap)
C61  value 100n  Tolerance: 10%  [CAPC0402-01]  (hidden comment: Cap)
C62  value 100n  Tolerance: 10%  [CAPC0402-01]  (hidden comment: Cap)
C63  value 4.7u  Tolerance: 20%  [CAPC0402-01]  (hidden comment: Cap)
C64  value 100n  Tolerance: 10%  [CAPC0402-01]  (hidden comment: Cap)
C65  value 4.7u  Tolerance: 20%  [CAPC0402-01]  (hidden comment: Cap)
C66  value 4.7u  Tolerance: 20%  [CAPC0402-01]  (hidden comment: Cap)
C67  value 2.2u  Tolerance: 20%  [CAPC0402-01]  (hidden comment: Cap_225M25VX5R0402_1)
C68  value 2.2u  Tolerance: 20%  [CAPC0402-01]  (hidden comment: Cap_225M25VX5R0402_1)
C69  value 10u 6V3  Case Size/Dimension: T0603  [CAP_0603_TCS_M_ROM-L]  (hidden comment: CAP-P)
C70  value 220p  Tolerance: 5%  [CAPC0402-01]  (hidden comment: Cap)
C71  value 1.0u  Tolerance: 10%  [CAPC0402-01]  (hidden comment: Cap)
C72  value 1.0u  Tolerance: 10%  [CAPC0402-01]  (hidden comment: Cap)
C73  value 220p  Tolerance: 5%  [CAPC0402-01]  (hidden comment: Cap)
C74  value 10u 6V3  Case Size/Dimension: T0603  [CAP_0603_TCS_M_ROM-L]  (hidden comment: CAP-P)
C75  value 1.0u  Tolerance: 10%  [CAPC0402-01]  (hidden comment: Cap)
C76  value 10u  Tolerance: 10%  [CAPC0402-01]  (hidden comment: Cap)
FB10  value WBC  Impedance: 120@100M  PCB_Footprint: 0402  RMS_Current: 1.5A  [FB_0402_MuRata_as_R0402]  (hidden comment: Ind_WBC_1A5_120@100M0402_1)
FB11  value WBC  [FB_0402_MuRata_as_R0402]  (hidden comment: Ind_WBC_1A5_120@100M0402_1)
J7  SJ-3524-SMT-TR-GR  Color: GREEN  [CONN_CUI_SJ-3524-SMT-TR-XX_CUD]
J8  SJ-3524-SMT-TR-BE  Color: BLUE  [CONN_CUI_SJ-3524-SMT-TR-XX_CUD]
R38  value 20R0  Tolerance: 1%  [RESC0402-01]  (hidden comment: Res3)
R39  value 20R0  Tolerance: 1%  [RESC0402-01]  (hidden comment: Res3)
R40  value 10K0  Tolerance: 1%  [RESC0402-01]  (hidden comment: Res3)
R41  value 5K62  Tolerance: 1%  [RESC0402-01]  (hidden comment: Res3)
R42  value 5K62  Tolerance: 1%  [RESC0402-01]  (hidden comment: Res3)
R43  value 5K62  Tolerance: 1%  [RESC0402-01]  (hidden comment: Res3)
R44  value 5K62  Tolerance: 1%  [RESC0402-01]  (hidden comment: Res3)
R45  value 10K0  Tolerance: 1%  [RESC0402-01]  (hidden comment: Res3)
R46  value 100K  Tolerance: 1%  [RESC0402-01]  (hidden comment: Res3)
R47  value 10K0  Tolerance: 1%  [RESC0402-01]  (hidden comment: Res3)
R48  value 20K0  Tolerance: 1%  [RESC0402-01]  (hidden comment: Res3)
S6  value 0R0  [RESC0402-01]  (hidden comment: Res3)
TP29  TP_SMPAD  [TP_30_RND]  (value not drawn)  (no BOM)
TP30  TP_SMPAD  [TP_30_RND]  (value not drawn)  (no BOM)
TP31  TP_SMPAD  [TP_30_RND]  (value not drawn)  (no BOM)
TP32  TP_SMPAD  [TP_30_RND]  (value not drawn)  (no BOM)
U9  WM8904CGEFL_V  [QFN40P400X400X80-33N]
U10  NCV8164ASNADJT1G  [TSOT23-5_ONS]
Y3  value 12M288  Tolerance: 20ppm  [OSC_4P_3225_1210_uChip_DSC1001DL5]  (hidden comment: XO_12M288)

### Ports
CODEC_IRQ (out), I2C_FB_SCL (out), I2C_FB_SDA (bidir), I2S_COD_SCLK (in), I2S_COD_SDI (in), I2S_COD_SDO (out), I2S_COD_WS (in)

### Nets
AG: C63.1 C64.1 C65.1 C66.1 C70.1 C73.1 C76.1 J7.1 J8.1 R38.1 R39.1 R40.2 R41.2 R44.2 R45.2 R48.2 S6.1 U9.14(HPOUTFB) U9.22(AGND)
GND: C55.1 C60.1 C61.1 C62.1 C67.1 C68.1 C75.1 S6.2 U9.5(DGND) U9.9(CPGND) U9.33(EP) U10.2(GND) Y3.2(G2)
V_1V8_C: C63.2 C64.2 C76.2 R47.1 TP32.1 U9.19(MICVDD) U9.23(AVDD) U10.5(OUT)
V_1V8_R: C55.2 C60.2 C61.2 C62.2 U9.4(DBVDD) U9.6(DCVDD) U9.7(CPVDD) Y3.1(G1) Y3.4(VDD)
VIN_RAW: C75.2 R46.2 U10.1(VIN)
CLK_CODEC: U9.28(MCLK) Y3.3(OUT)
HEADP_L: C58.1 FB11.2 J7.2
HEADP_R: C58.2 FB10.2 J7.3
I2C_FB_SCL: U9.2(SCLK) ; port I2C_FB_SCL
I2C_FB_SDA: U9.3(SDA) ; port I2C_FB_SDA
I2S_COD_SCLK: U9.29(BCLK/GPIO4) ; port I2S_COD_SCLK
I2S_COD_WS: U9.30(LRCLK) ; port I2S_COD_WS
LINE_IN_L: C69.2 C71.1 R40.1 U9.26(IN2L)
LINE_IN_R: C72.1 C74.2 R45.1 U9.24(IN2R)
LINE_OUT_FB: TP31.1 U9.17(LINEOUTFB)
LINE_OUT_L: TP30.1 U9.16(LINEOUTL)
LINE_OUT_R: TP29.1 U9.18(LINEOUTR)
LINEIN_L: J8.2 R42.1
LINEIN_R: J8.3 R43.1
P2_4: U9.31(ADCDAT) ; port I2S_COD_SDI
P2_5: U9.32(DACDAT) ; port I2S_COD_SDO
P6_7: U9.1(IRQ/GPIO1) ; port CODEC_IRQ
PA_OUT_L: C57.1 FB11.1 U9.13(HPOUTL)
PA_OUT_R: C56.1 FB10.1 U9.15(HPOUTR)
NetC56_2: C56.2 R38.2
NetC57_2: C57.2 R39.2
NetC59_1: C59.1 U9.10(CPCB)
NetC59_2: C59.2 U9.8(CPCA)
NetC65_2: C65.2 U9.21(VMIDC)
NetC66_2: C66.2 U9.20(MICBIAS)
NetC67_2: C67.2 U9.11(CPVOUTP)
NetC68_2: C68.2 U9.12(CPVOUTN)
NetC69_1: C69.1 C70.2 C71.2 R41.1 R42.2
NetC72_2: C72.2 C73.2 C74.1 R43.2 R44.1
NetR46_1: R46.1 U10.3(EN)
NetR47_2: R47.2 R48.1 U10.4(ADJ)

Not connected (* = marked no-connect by the designer): J7 4; J8 4; U9 25(IN1R/DMICDAT2) 27(IN1L/DMICDAT1)

### Notes on the sheet
- Low Noise 1.8V
- System 1.8V
- I2S Audio CODEC
- 1.8V LDO
- DWG. NO.
- REV
- SHT
- REVISION
- DESCRIPTION
- DATE
- APPROVED
- ENG:
- APPROVALS
- PROJECT
- Suite 300
- Alif Semiconductor
- 7901 Stoneridge Drive
- DSN:
- CHK:
- REFERENCE DOCUMENTS
- TITLE
- Pleasanton, CA 94588  USA
- BOM:
- FAB DWG:
- PCB DWG:
- ASSY DWG:
- SCALE:
- SIZE
- B
- CAGE CODE
- FILE NAME
- DWG NO.
- SHEET
- OF
- none

### Library data of the parts
C55-C57 C61 C62 C64 = Cap: as C21 on sheet 3-CPUPower; Published: 8-Jun-2000; LatestRevisionDate: 17-Jul-2002; LatestRevisionNote: Re-released for DXP Platform.; PackageReference: RAD-0.3; Publisher: Altium Limited; PackageDescription: Radial Cap, Thru-Hole; 2 Leads; 0.3 in Pin Spacing; Max_Height: 0.60mm; Manufacturer 2: Samsung; Manufacturer Part Number 2: CL05B104KB54PNC; Manufacturer 3: Walsin; Manufacturer Part Number 3: 0402B104K500CT; Type: X7R; Voltage: 50V
C58 = Cap: Cap,100pF,5%,25V,C0G,Hi-Q,0402; Manufacturer 1: Kemet; Manufacturer Part Number 1: CBR04C101J3GAC; PCB_Footprint: CC0402; Published: 8-Jun-2000; LatestRevisionDate: 17-Jul-2002; LatestRevisionNote: Re-released for DXP Platform.; PackageReference: RAD-0.3; Publisher: Altium Limited; PackageDescription: Radial Cap, Thru-Hole; 2 Leads; 0.3 in Pin Spacing; Max_Height: 0.60mm; Manufacturer 2: Kemet; Manufacturer Part Number 2: CBR04C101G3GAC; Manufacturer 3: Walsin; Manufacturer Part Number 3: RF15N101J250CT; Type: C0G; Voltage: 25V
C59 C67 C68 = Cap_225M25VX5R0402_1: as C6 on sheet 2-PowerInput; Published: 8-Jun-2000; LatestRevisionDate: 17-Jul-2002; LatestRevisionNote: Re-released for DXP Platform.; PackageReference: RAD-0.3; Publisher: Altium Limited; PackageDescription: Radial Cap, Thru-Hole; 2 Leads; 0.3 in Pin Spacing; Max_Height: 0.60mm; Type: X5R; Voltage: 25V; Manufacturer 2: Murata; Manufacturer Part Number 2: GRM155R61E225ME11D; Manufacturer 3: Murata; Manufacturer Part Number 3: GRM155R61E225ME15D
C60 C63 C65 C66 = Cap_225M25VX5R0402_1: as C86 on sheet 3-CPUPower; Published: 8-Jun-2000; LatestRevisionDate: 17-Jul-2002; LatestRevisionNote: Re-released for DXP Platform.; PackageReference: RAD-0.3; Publisher: Altium Limited; PackageDescription: Radial Cap, Thru-Hole; 2 Leads; 0.3 in Pin Spacing; Max_Height: 0.60mm; Type: X5R; Voltage: 10V; Manufacturer 2: Kyocera; Manufacturer Part Number 2: 0402YD475MAT2A; Manufacturer 3: Samsung; Manufacturer Part Number 3: CL05A475MP5NRNC
C69 C74 = CAP-P: Cap, Tant, 10uF, 6V3-10V, 10%-20%, 0603; Manufacturer 1: Kyocera; Manufacturer Part Number 1: TACL106M010XTA; Impedance: 0.03O; Ripple Current: 1650mA; Lifetime@Temperature: 4000Hrs@105degC; Type: Radial; Operating Temp Range: -40to+105degC; Manufacturer 2: Kyocera; Manufacturer Part Number 2: TACL106M010XTA; Manufacturer 3: Vishay; Manufacturer Part Number 3: 298D106X06R3M2T
C70 C73 = Cap: Cap,220pF,5%,50V,C0G,0402; Manufacturer 1: MuRata; Manufacturer Part Number 1: GRM1555C1H221JA01D; PCB_Footprint: CC0402; Published: 8-Jun-2000; LatestRevisionDate: 17-Jul-2002; LatestRevisionNote: Re-released for DXP Platform.; PackageReference: RAD-0.3; Publisher: Altium Limited; PackageDescription: Radial Cap, Thru-Hole; 2 Leads; 0.3 in Pin Spacing; Max_Height: 0.60mm; Manufacturer 2: Kemet; Manufacturer Part Number 2: C0402C221J5GACTU; Manufacturer 3: TDK; Manufacturer Part Number 3: C1005C0G1H221J050BA; Type: C0G; Voltage: 50V
C71 C72 C75 = Cap: as C1 on sheet 2-PowerInput; Published: 8-Jun-2000; LatestRevisionDate: 17-Jul-2002; LatestRevisionNote: Re-released for DXP Platform.; PackageReference: RAD-0.3; Publisher: Altium Limited; PackageDescription: Radial Cap, Thru-Hole; 2 Leads; 0.3 in Pin Spacing; Max_Height: 0.60mm; Manufacturer 2: Yageo; Manufacturer Part Number 2: CC0402KRX5R8BB105; Manufacturer 3: Murata; Manufacturer Part Number 3: GRM155R61E105KA12D; Type: X5R; Voltage: 25V
C76 = Cap: as C4 on sheet 2-PowerInput; Published: 8-Jun-2000; LatestRevisionDate: 17-Jul-2002; LatestRevisionNote: Re-released for DXP Platform.; PackageReference: RAD-0.3; Publisher: Altium Limited; PackageDescription: Radial Cap, Thru-Hole; 2 Leads; 0.3 in Pin Spacing; Max_Height: 0.60mm; Manufacturer 2: Samsung; Manufacturer Part Number 2: CL05A106MP5NUNC; Manufacturer 3: Venkel; Manufacturer Part Number 3: C0402X5R100-106MNP; Type: X5R; Voltage: 10V
FB10 = Ind_WBC_1A5_120@100M0402_1: as FB1 on sheet 2-PowerInput; Published: 8-Jun-2000; LatestRevisionDate: 29-May-2009; LatestRevisionNote: IPC-7351 Footprint Added.; PackageReference: 0402-A; Publisher: Altium Limited; PackageDescription: Chip Inductor; Code_JEITA: 0402; Sat_Current: *; Type: *; Manufacturer 2: *; Manufacturer Part Number 2: *; Manufacturer 3: *; Manufacturer Part Number 3: *; Max_Height: 0.60mm
FB11 = Ind_WBC_1A5_120@100M0402_1: as FB2 on sheet 2-PowerInput; Published: 8-Jun-2000; LatestRevisionDate: 29-May-2009; LatestRevisionNote: IPC-7351 Footprint Added.; PackageReference: 0402-A; Publisher: Altium Limited; PackageDescription: Chip Inductor; Code_JEITA: 0402; Sat_Current: *; Type: *; Manufacturer 2: *; Manufacturer Part Number 2: *; Manufacturer 3: *; Manufacturer Part Number 3: *; Max_Height: 0.60mm; Impedance: 120@100M; RMS_Current: 1.5A
J7 = CONN_SJ-3524-SMT-TR-XX: Conn, Audio Jack, 3.5 mm Low Profile Surface Mount Stereo Jack, 3 Pin Right-Angle, XX = color GREEN; Mfr_Name: CUI Devices; Manufacturer 1: CUI; RefDes: RefDes; Type: Type; Manufacturer Part Number 1: SJ-3524-SMT-TR-GR; Manufacturer 2: *; Manufacturer Part Number 2: *
J8 = CONN_SJ-3524-SMT-TR-XX: Conn, Audio Jack, 3.5 mm Low Profile Surface Mount Stereo Jack, 3 Pin Right-Angle, XX = color BLUE; Mfr_Name: CUI Devices; Manufacturer 1: CUI; RefDes: RefDes; Type: Type; Manufacturer Part Number 1: SJ-3524-SMT-TR-BE; Manufacturer 2: *; Manufacturer Part Number 2: *
R38 R39 = Res3: Res,20R0,1%,100ppm,0402; Manufacturer 1: Stackpol; Manufacturer Part Number 1: RMCF0402FT20R; Wattage: 63mW; PCB_Footprint: R0402; Published: 8-Jun-2000; LatestRevisionDate: 29-May-2009; LatestRevisionNote: IPC-7351 Footprint Added.; PackageReference: RESC0402-01; Publisher: Altium Limited; PackageDescription: Chip Resistor; Voltage: *; Type: Thick Film; Manufacturer 2: Yageo; Manufacturer Part Number 2: RC0402FR-0720RL; Manufacturer 3: Bourns; Manufacturer Part Number 3: CR0402-FX-20R0GLF
R40 R45 R47 = Res3: Res,10K0,1%,100ppm,0402; Manufacturer 1: Stackpol; Manufacturer Part Number 1: RMCF0402FT10K0; Wattage: 63mW; PCB_Footprint: R0402; Published: 8-Jun-2000; LatestRevisionDate: 29-May-2009; LatestRevisionNote: IPC-7351 Footprint Added.; PackageReference: RESC0402-01; Publisher: Altium Limited; PackageDescription: Chip Resistor; Voltage: *; Type: Thick Film; Manufacturer 2: Yageo; Manufacturer Part Number 2: RC0402FR-0710KL; Manufacturer 3: Bourns; Manufacturer Part Number 3: CR0402-FX-1002GLF
R41-R44 = Res3: Res,5K62,1%,100ppm,0402; Manufacturer 1: Stackpol; Manufacturer Part Number 1: RMCF0402FT5K62; Wattage: 63mW; PCB_Footprint: R0402; Published: 8-Jun-2000; LatestRevisionDate: 29-May-2009; LatestRevisionNote: IPC-7351 Footprint Added.; PackageReference: RESC0402-01; Publisher: Altium Limited; PackageDescription: Chip Resistor; Voltage: *; Type: Thick Film; Manufacturer 2: Yageo; Manufacturer Part Number 2: RC0402FR-075K62L; Manufacturer 3: Bourns; Manufacturer Part Number 3: CR0402-FX-5621GLF
R46 = Res3: as R11 on sheet 2-PowerInput; Published: 8-Jun-2000; LatestRevisionDate: 29-May-2009; LatestRevisionNote: IPC-7351 Footprint Added.; PackageReference: RESC0402-01; Publisher: Altium Limited; PackageDescription: Chip Resistor; Voltage: *; Type: Thick Film; Manufacturer 2: Yageo; Manufacturer Part Number 2: RC0402FR-07100KL; Manufacturer 3: Bourns; Manufacturer Part Number 3: CR0402-FX-1003GLF; PCB_Footprint: RESC0402-01
R48 = Res3: as R25 on sheet 3-CPUPower; Published: 8-Jun-2000; LatestRevisionDate: 29-May-2009; LatestRevisionNote: IPC-7351 Footprint Added.; PackageReference: RESC0402-01; Publisher: Altium Limited; PackageDescription: Chip Resistor; Voltage: *; Type: Thick Film; Manufacturer 2: Yageo; Manufacturer Part Number 2: RC0402FR-0720KL; Manufacturer 3: Bourns; Manufacturer Part Number 3: CR0402-FX-2002GLF; PCB_Footprint: RESC0402-01
S6 = Res3: as R16 on sheet 4-CPUMipiXo; Published: 8-Jun-2000; LatestRevisionDate: 29-May-2009; LatestRevisionNote: IPC-7351 Footprint Added.; PackageReference: RESC0402-01; Publisher: Altium Limited; PackageDescription: Chip Resistor; Voltage: *; Type: Thick Film; Manufacturer 2: Yageo; Manufacturer Part Number 2: RC0402FR-070RL; Manufacturer 3: Panasonic; Manufacturer Part Number 3: ERJ-XGN0R00Y; PCB_Footprint: RESC0402-01
TP29-TP32 = TP_SMPAD: as TP1 on sheet 2-PowerInput
U9 = IC_CODEC_WM8904CGEFL_V: IC, Audio CODEC, Ultra Low Pwr, 1.8V, QFN32; Manufacturer 1: Cirrus Logic; Manufacturer Part Number 1: WM8904CGEFL/V; Geometry.Height: 0.8mm; Mouser Part Number: 238-WM8904CGEFL/V; Mouser Price/Stock: https://www.mouser.co.uk/ProductDetail/Cirrus-Logic/WM8904CGEFL-V?qs=G8wrXCBxhFucvRVD%2FY2Zqw%3D%3D; Datasheet Link: https://statics.cirrus.com/pubs/proDatasheet/WM8904_Rev4.0.pdf
U10 = IC_LDO_NCV8164ASNADJT1G: IC, LDO,Adj 1.2V - 5.5V,300mA,SOT23-5; Manufacturer 1: OnSemi; Manufacturer Part Number 1: NCV8164ASNADJT1G
Y3 = Osc_12M288_20ppm_1V8_3225: Oscillator, XO, 12.288MHz, 20ppm, 1.8V, 2520(1008)-4P; Manufacturer 1: Epson; Manufacturer Part Number 1: SG-8101CG 12.2888M-TCHPA; PCB_Footprint: OSC1210-4P; Published: 8-Jun-2000; LatestRevisionDate: 17-Jul-2002; LatestRevisionNote: Re-released for DXP Platform.; PackageReference: *; Publisher: Altium Limited; PackageDescription: Crystal, Thru-Hole; 2 Leads; Body 3.1 x 8.2 mm (Dia.xH); Manufacturer 2: Microchip; Manufacturer Part Number 2: DSC1001DL5-012.2880; Manufacturer 3: Kyocera; Manufacturer Part Number 3: KC2520Z12.2880C1KX00